# EAGLE schematic GIMBALL_CONTROLLER (EAGLE 9.4.2)
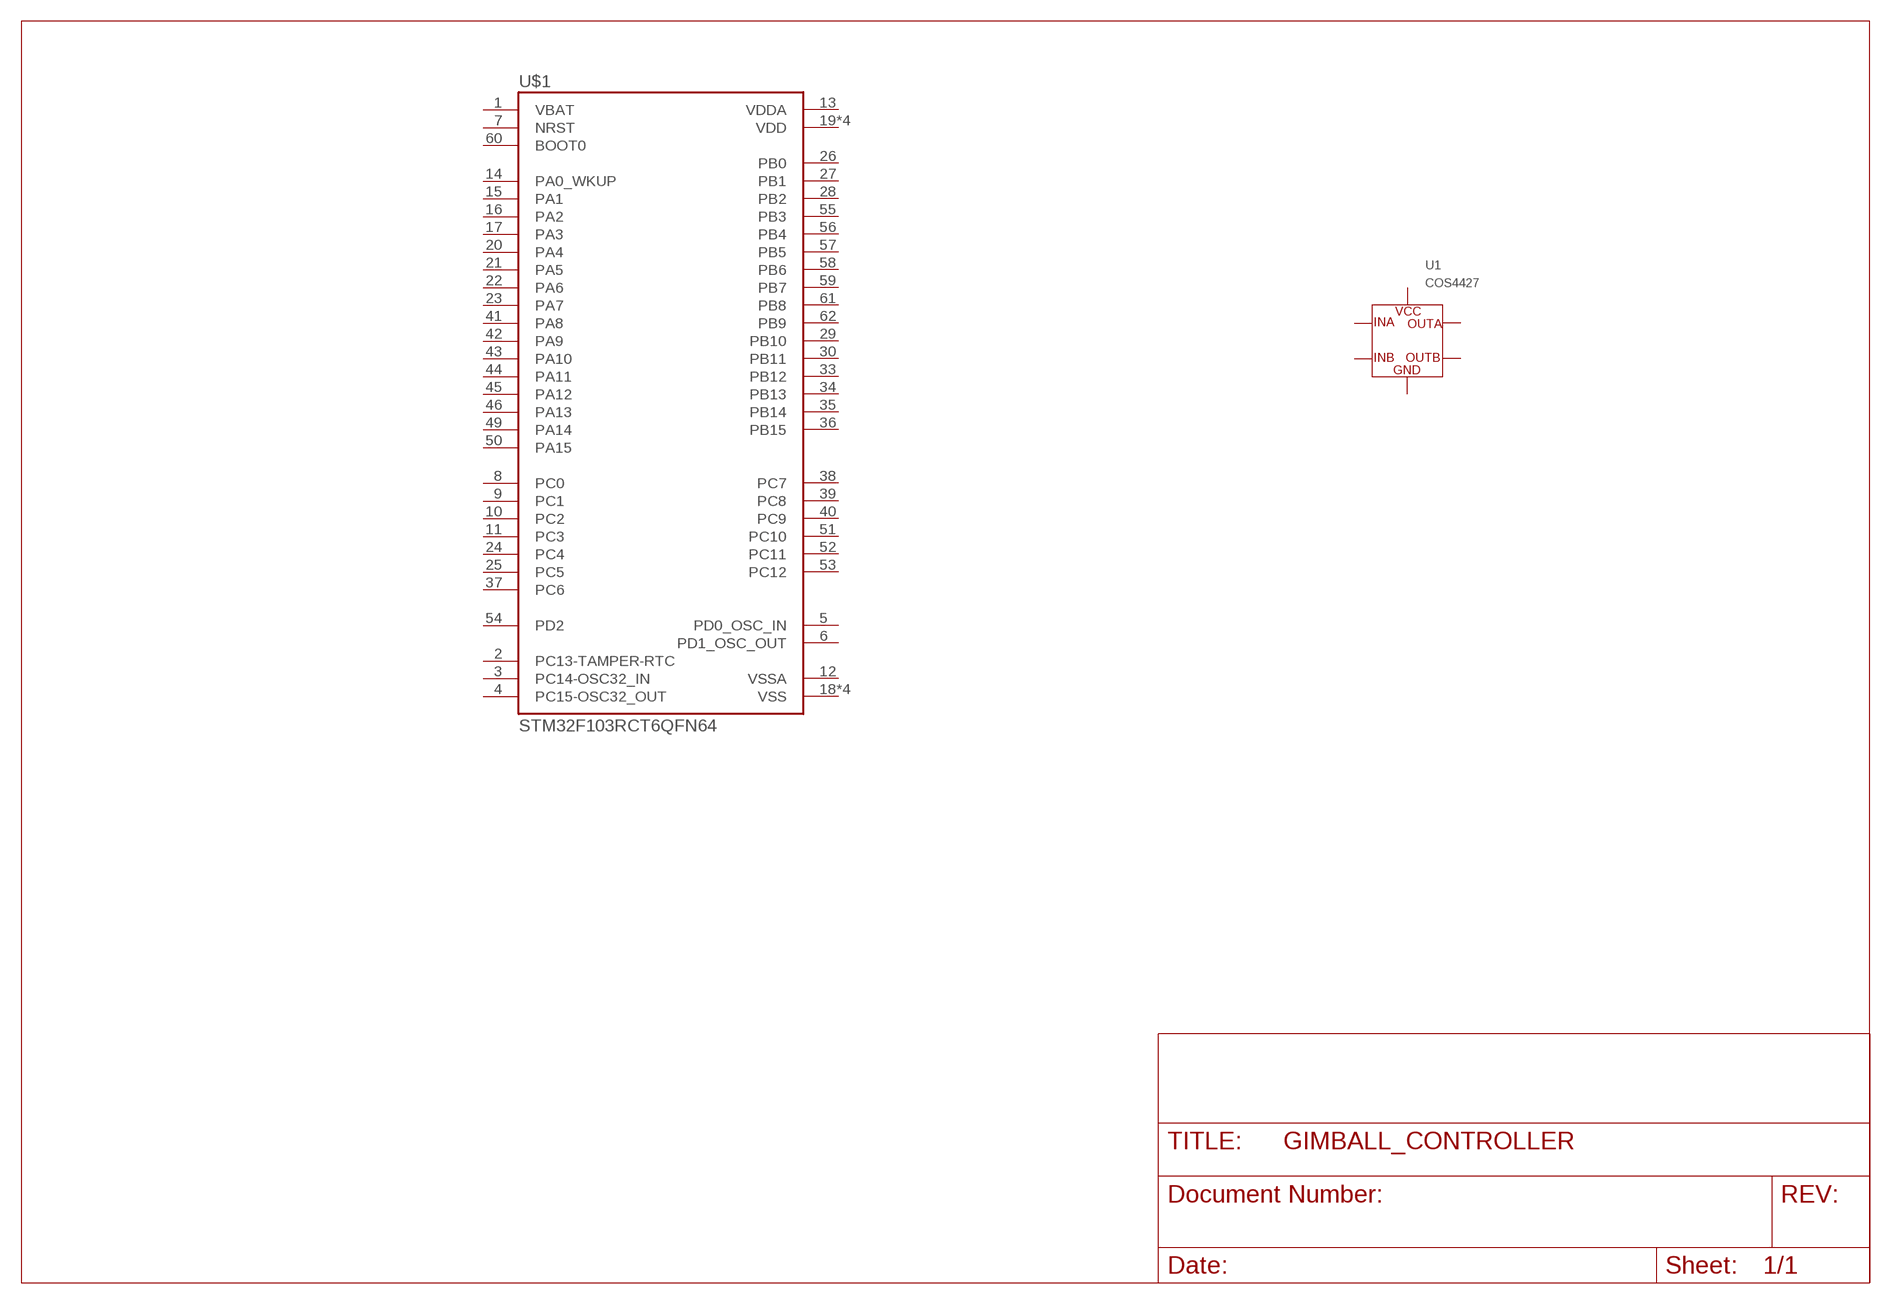
[diagram p0: schematic, sheet 1]

## Parts
U1  COS4427  [SOIC-8]
U$1  STM32F103RCT6QFN64  [QFP50P1200X1200X160-64N]
Unconnected: U1.2(INA) U1.3(GND) U1.4(INB) U1.5(OUTB) U1.6(VCC) U1.7(OUTA) U$1.1(VBAT) U$1.2(PC13-TAMPER-RTC) U$1.3(PC14-OSC32_IN) U$1.4(PC15-OSC32_OUT) U$1.5(PD0_OSC_IN) U$1.6(PD1_OSC_OUT) U$1.7(NRST) U$1.8(PC0) U$1.9(PC1) U$1.10(PC2) U$1.11(PC3) U$1.14(PA0_WKUP) U$1.15(PA1) U$1.16(PA2) U$1.17(PA3) U$1.20(PA4) U$1.21(PA5) U$1.22(PA6) U$1.23(PA7) U$1.24(PC4) U$1.25(PC5) U$1.26(PB0) U$1.27(PB1) U$1.28(PB2) U$1.29(PB10) U$1.30(PB11) U$1.33(PB12) U$1.34(PB13) U$1.35(PB14) U$1.36(PB15) U$1.37(PC6) U$1.38(PC7) U$1.39(PC8) U$1.40(PC9) U$1.41(PA8) U$1.42(PA9) U$1.43(PA10) U$1.44(PA11) U$1.45(PA12) U$1.46(PA13) U$1.49(PA14) U$1.50(PA15) U$1.51(PC10) U$1.52(PC11) U$1.53(PC12) U$1.54(PD2) U$1.55(PB3) U$1.56(PB4) U$1.57(PB5) U$1.58(PB6) U$1.59(PB7) U$1.60(BOOT0) U$1.61(PB8) U$1.62(PB9)

## Power pins joined to a net without a drawn wire
VDD: U$1.19(VDD) U$1.32(VDD) U$1.48(VDD) U$1.64(VDD)
VDDA: U$1.13(VDDA)
VSS: U$1.18(VSS) U$1.31(VSS) U$1.47(VSS) U$1.63(VSS)
VSSA: U$1.12(VSSA)

## Library data of the parts
U1 = LARS_409_MC:COS4427
U$1 = LARS_409_MK:STM32F103RCT6